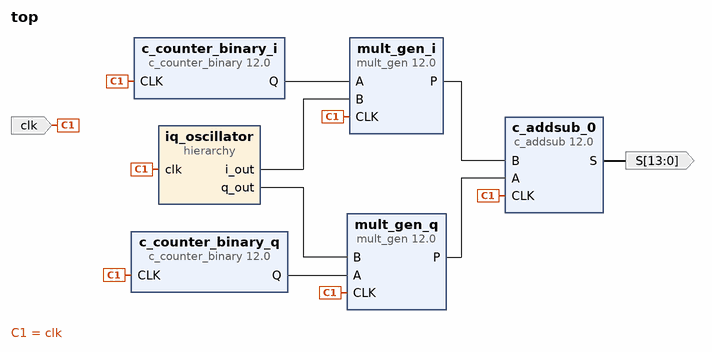
[diagram p0: block diagram of the top level]
# Vivado block design top, xc7s6ftgb196-1, Vivado 2020.2
create_bd_design top

create_bd_port -dir O -from 13 -to 0 -type data S
create_bd_port -dir I -type clk clk
set_property -dict {CONFIG.FREQ_HZ 125000000} [get_bd_ports clk]

create_bd_cell -type ip -vlnv xilinx.com:ip:c_addsub:12.0 c_addsub_0
set_property -dict [list \
  CONFIG.A_Width 13 \
  CONFIG.B_Value 0000000000000 \
  CONFIG.B_Width 13 \
  CONFIG.CE false \
  CONFIG.Implementation Fabric \
  CONFIG.Latency 1 \
  CONFIG.Out_Width 14 \
] [get_bd_cells c_addsub_0]
create_bd_cell -type ip -vlnv xilinx.com:ip:c_counter_binary:12.0 c_counter_binary_i
set_property -dict {CONFIG.Increment_Value 11 CONFIG.Output_Width 14} [get_bd_cells c_counter_binary_i]
create_bd_cell -type ip -vlnv xilinx.com:ip:c_counter_binary:12.0 c_counter_binary_q
set_property -dict {CONFIG.Increment_Value 13 CONFIG.Output_Width 14} [get_bd_cells c_counter_binary_q]
create_bd_cell -type hier iq_oscillator
create_bd_cell -type ip -vlnv xilinx.com:ip:mult_gen:12.0 mult_gen_i
set_property -dict [list \
  CONFIG.Multiplier_Construction Use_Mults \
  CONFIG.OutputWidthHigh 21 \
  CONFIG.OutputWidthLow 9 \
  CONFIG.PortAType Unsigned \
  CONFIG.PortAWidth 14 \
  CONFIG.PortBType Signed \
  CONFIG.PortBWidth 8 \
  CONFIG.Use_Custom_Output_Width true \
] [get_bd_cells mult_gen_i]
create_bd_cell -type ip -vlnv xilinx.com:ip:mult_gen:12.0 mult_gen_q
set_property -dict [list \
  CONFIG.Multiplier_Construction Use_Mults \
  CONFIG.OutputWidthHigh 21 \
  CONFIG.OutputWidthLow 9 \
  CONFIG.PortAType Unsigned \
  CONFIG.PortAWidth 14 \
  CONFIG.PortBType Signed \
  CONFIG.PortBWidth 8 \
  CONFIG.Use_Custom_Output_Width true \
] [get_bd_cells mult_gen_q]

# ---- hierarchy /iq_oscillator ----
current_bd_instance /iq_oscillator
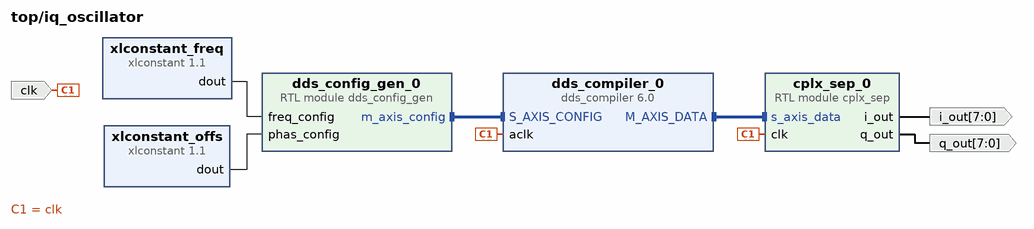
[diagram p1: block diagram inside /iq_oscillator]
create_bd_pin -dir I -type clk clk
create_bd_pin -dir O -from 7 -to 0 q_out
create_bd_pin -dir O -from 7 -to 0 i_out

create_bd_cell -type module -reference dds_config_gen dds_config_gen_0
create_bd_cell -type module -reference cplx_sep cplx_sep_0
create_bd_cell -type ip -vlnv xilinx.com:ip:dds_compiler:6.0 dds_compiler_0
set_property -dict [list \
  CONFIG.DATA_Has_TLAST Not_Required \
  CONFIG.DDS_Clock_Rate 125 \
  CONFIG.Frequency_Resolution 1 \
  CONFIG.Latency 4 \
  CONFIG.Noise_Shaping Auto \
  CONFIG.Output_Frequency1 0 \
  CONFIG.Output_Width 8 \
  CONFIG.PINC1 0 \
  CONFIG.Phase_Increment Programmable \
  CONFIG.Phase_Width 27 \
  CONFIG.Phase_offset Programmable \
  CONFIG.S_PHASE_Has_TUSER Not_Required \
] [get_bd_cells dds_compiler_0]
create_bd_cell -type ip -vlnv xilinx.com:ip:xlconstant:1.1 xlconstant_freq
set_property -dict {CONFIG.CONST_VAL 34000000 CONFIG.CONST_WIDTH 27} [get_bd_cells xlconstant_freq]
create_bd_cell -type ip -vlnv xilinx.com:ip:xlconstant:1.1 xlconstant_offs
set_property -dict {CONFIG.CONST_VAL 0 CONFIG.CONST_WIDTH 27} [get_bd_cells xlconstant_offs]

# ---- connections ----

current_bd_instance /iq_oscillator
connect_bd_intf_net [get_bd_intf_pins cplx_sep_0/s_axis_data] [get_bd_intf_pins dds_compiler_0/M_AXIS_DATA]
connect_bd_intf_net [get_bd_intf_pins dds_config_gen_0/m_axis_config] [get_bd_intf_pins dds_compiler_0/S_AXIS_CONFIG]
connect_bd_net [get_bd_pins clk] [get_bd_pins cplx_sep_0/clk] [get_bd_pins dds_compiler_0/aclk]
connect_bd_net [get_bd_pins xlconstant_freq/dout] [get_bd_pins dds_config_gen_0/freq_config]
connect_bd_net [get_bd_pins xlconstant_offs/dout] [get_bd_pins dds_config_gen_0/phas_config]
connect_bd_net [get_bd_pins cplx_sep_0/q_out] [get_bd_pins q_out]
connect_bd_net [get_bd_pins cplx_sep_0/i_out] [get_bd_pins i_out]

current_bd_instance /
connect_bd_net [get_bd_pins c_addsub_0/S] [get_bd_ports S]
connect_bd_net [get_bd_pins c_counter_binary_i/Q] [get_bd_pins mult_gen_i/A]
connect_bd_net [get_bd_pins c_counter_binary_q/Q] [get_bd_pins mult_gen_q/A]
connect_bd_net [get_bd_ports clk] \
  [get_bd_pins iq_oscillator/clk] [get_bd_pins c_addsub_0/CLK] [get_bd_pins c_counter_binary_i/CLK] \
  [get_bd_pins c_counter_binary_q/CLK] [get_bd_pins mult_gen_i/CLK] [get_bd_pins mult_gen_q/CLK]
connect_bd_net [get_bd_pins iq_oscillator/i_out] [get_bd_pins mult_gen_i/B]
connect_bd_net [get_bd_pins iq_oscillator/q_out] [get_bd_pins mult_gen_q/B]
connect_bd_net [get_bd_pins mult_gen_i/P] [get_bd_pins c_addsub_0/B]
connect_bd_net [get_bd_pins mult_gen_q/P] [get_bd_pins c_addsub_0/A]

validate_bd_design
save_bd_design
